# Altium schematic sheet micro_avr_prog_header_3x2.SchDoc
size A
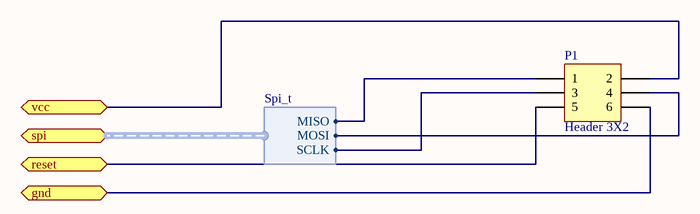
[diagram p0: micro_avr_prog_header_3x2.SchDoc]

## Parts
P1  Header 3X2  [HDR2X3]

## Ports
gnd, reset, spi (harness Spi_t), vcc

## Harnesses
Spi_t: MISO, MOSI, SCLK

## Nets
gnd: P1.6 ; port gnd
reset: P1.5 ; port reset
vcc: P1.2 ; port vcc
NetP1_1: P1.1 ; port spi.MISO
NetP1_3: P1.3 ; port spi.SCLK
NetP1_4: P1.4 ; port spi.MOSI

## Library data of the parts
P1 = Header 3X2: Header, 3-Pin, Dual row; LatestRevisionDate: 17-Jul-2002; LatestRevisionNote: Re-released for DXP Platform.; Publisher: Altium Limited